# EAGLE design UI-Board (EAGLE 9.2.0)
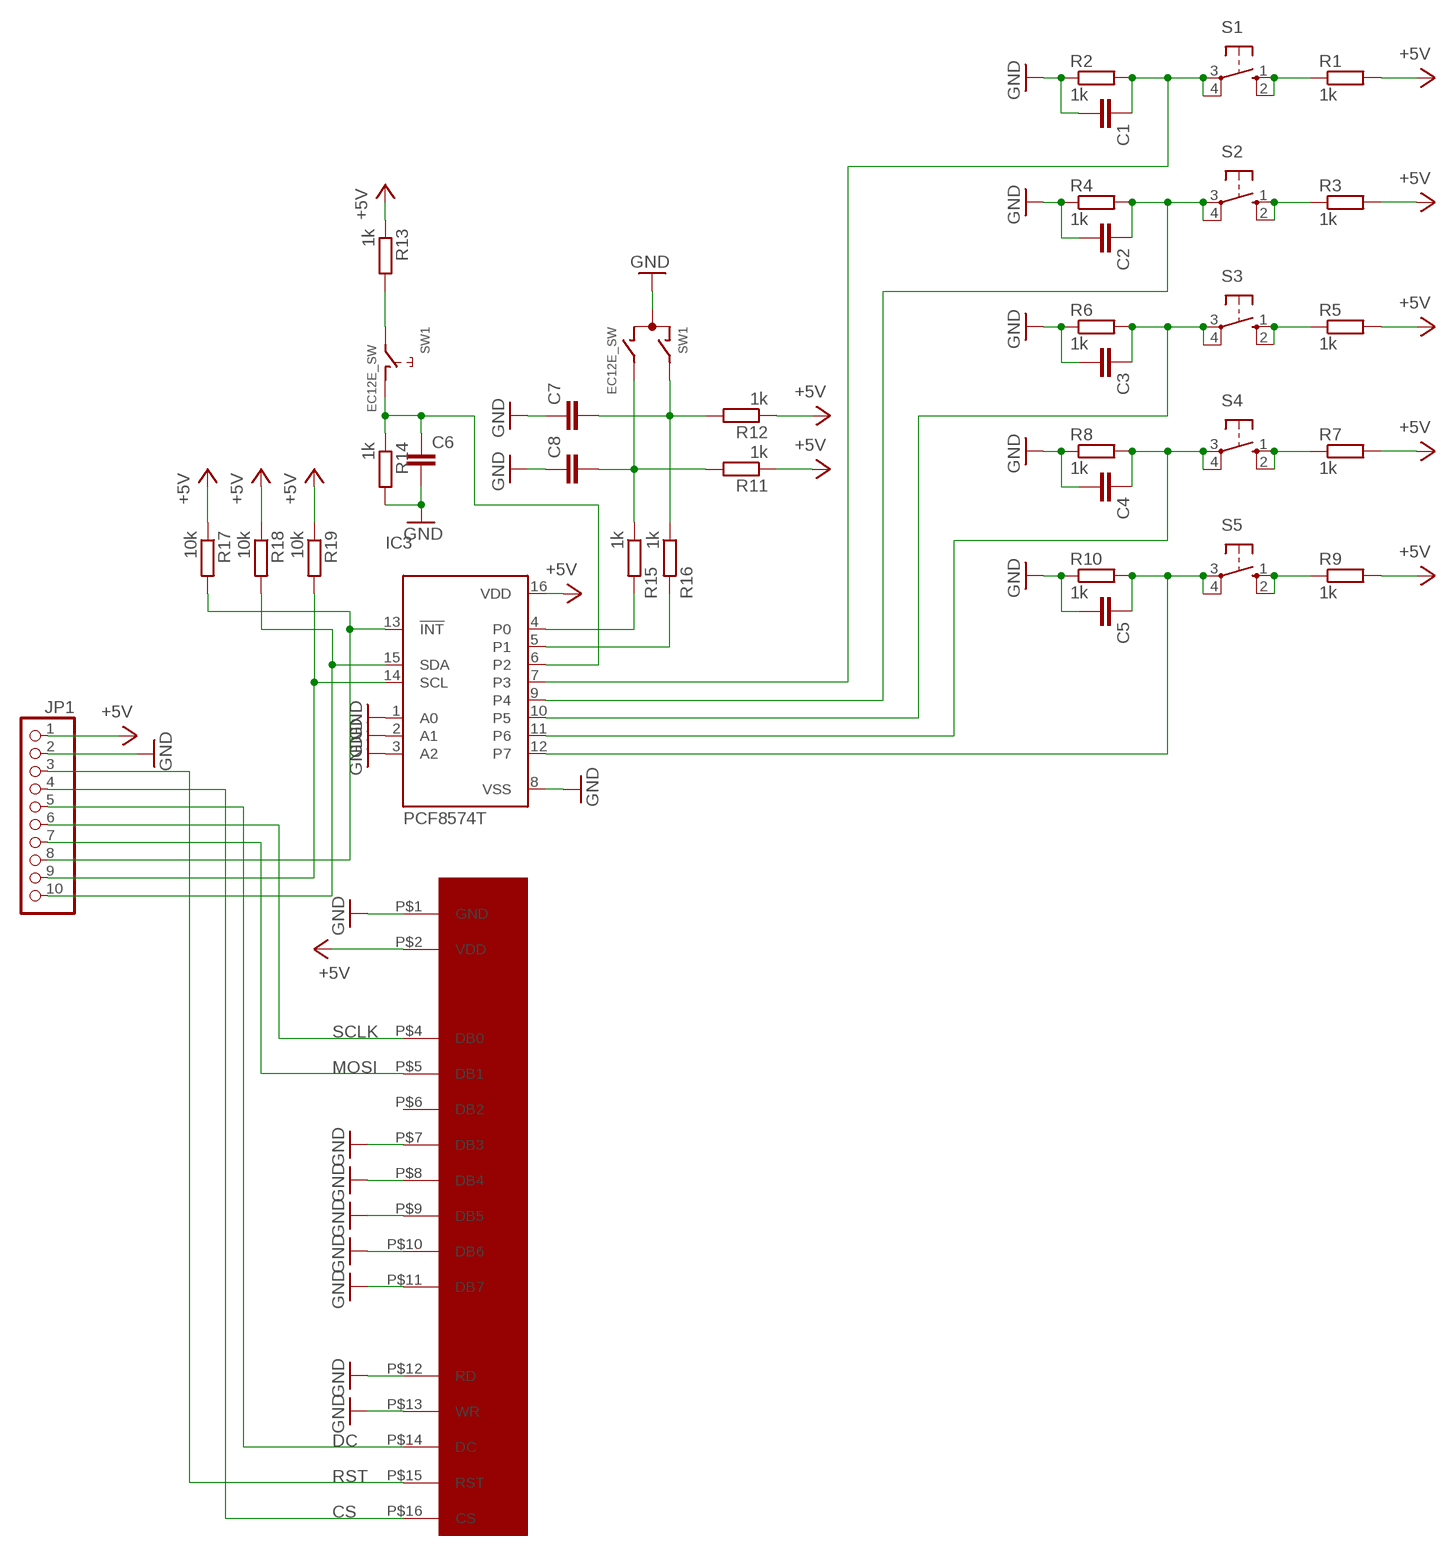
[diagram p0: schematic, sheet 1]

## Parts
C1  C-EUC0805  [C0805]
C2  C-EUC0805  [C0805]
C3  C-EUC0805  [C0805]
C4  C-EUC0805  [C0805]
C5  C-EUC0805  [C0805]
C6  C-EUC0805  [C0805]
C7  C-EUC0805  [C0805]
C8  C-EUC0805  [C0805]
IC3  PCF8574T  [SO16W]
JP1  PINHD-1X10/90  [1X10/90]
R1  1k  R-EU_R0805  [R0805]
R2  1k  R-EU_R0805  [R0805]
R3  1k  R-EU_R0805  [R0805]
R4  1k  R-EU_R0805  [R0805]
R5  1k  R-EU_R0805  [R0805]
R6  1k  R-EU_R0805  [R0805]
R7  1k  R-EU_R0805  [R0805]
R8  1k  R-EU_R0805  [R0805]
R9  1k  R-EU_R0805  [R0805]
R10  1k  R-EU_R0805  [R0805]
R11  1k  R-EU_R0805  [R0805]
R12  1k  R-EU_R0805  [R0805]
R13  1k  R-EU_R0805  [R0805]
R14  1k  R-EU_R0805  [R0805]
R15  1k  R-EU_R0805  [R0805]
R16  1k  R-EU_R0805  [R0805]
R17  10k  R-EU_R0805  [R0805]
R18  10k  R-EU_R0805  [R0805]
R19  10k  R-EU_R0805  [R0805]
S1  10-XX  [B3F-10XX]
S2  10-XX  [B3F-10XX]
S3  10-XX  [B3F-10XX]
S4  10-XX  [B3F-10XX]
S5  10-XX  [B3F-10XX]
SW1  EC12E_SW  [ALPS_EC12E_SW]
U$1  OLED64X256  [OLED64X256]

## Nets
+5V: IC3.16(VDD) JP1.1 R1.2 R3.2 R5.2 R7.2 R9.2 R11.1 R12.1 R13.1 R17.1 R18.1 R19.1 U$1.P$2(VDD)
CS: JP1.4 U$1.P$16(CS)
DC: JP1.5 U$1.P$14(DC)
GND: C1.2 C2.2 C3.2 C4.2 C5.2 C6.2 C7.1 C8.1 IC3.1(A0) IC3.2(A1) IC3.3(A2) IC3.8(VSS) JP1.2 R2.1 R4.1 R6.1 R8.1 R10.1 R14.2 SW1.C U$1.P$1(GND) U$1.P$7(DB3) U$1.P$8(DB4) U$1.P$9(DB5) U$1.P$10(DB6) U$1.P$11(DB7) U$1.P$12(RD) U$1.P$13(WR)
INT: IC3.13(!INT) JP1.8 R17.2
MOSI: JP1.7 U$1.P$5(DB1)
N$14: R1.1 S1.1(S) S1.2(S1)
N$15: R3.1 S2.1(S) S2.2(S1)
N$16: R5.1 S3.1(S) S3.2(S1)
N$17: R7.1 S4.1(S) S4.2(S1)
N$18: R9.1 S5.1(S) S5.2(S1)
N$19: IC3.4(P0) R15.2
N$20: C5.1 IC3.12(P7) R10.2 S5.3(P) S5.4(P1)
N$21: C4.1 IC3.11(P6) R8.2 S4.3(P) S4.4(P1)
N$22: C3.1 IC3.10(P5) R6.2 S3.3(P) S3.4(P1)
N$23: C2.1 IC3.9(P4) R4.2 S2.3(P) S2.4(P1)
N$24: C1.1 IC3.7(P3) R2.2 S1.3(P) S1.4(P1)
N$25: IC3.5(P1) R16.2
N$26: C8.2 R11.2 R15.1 SW1.B
N$27: C7.2 R12.2 R16.1 SW1.A
N$28: C6.1 IC3.6(P2) R14.1 SW1.D
N$31: R13.2 SW1.E
RST: JP1.3 U$1.P$15(RST)
SCL: IC3.14(SCL) JP1.9 R19.2
SCLK: JP1.6 U$1.P$4(DB0)
SDA: IC3.15(SDA) JP1.10 R18.2
Unconnected: SW1.GND1(G) SW1.GND2(G) U$1.P$6(DB2)

## Library data of the parts
C1-C8 = rcl:C-EU: CAPACITOR, European symbol; SPICEPREFIX: C
IC3 = micro-philips:PCF8574: I2C-Bus Remote 8-bit I/O expander http://www.semiconductors.philips.com/acrobat_download/datasheets/PCF8574_4.pdf; MPN: PCF8574T/3,512; OC_FARNELL: 1201255; OC_NEWARK: 70R6870
JP1 = pinhead:PINHD-1X10: PIN HEADER
R1-R19 = rcl:R-EU_: RESISTOR, European symbol; SPICEPREFIX: R
S1-S5 = switch-omron:10-XX: OMRON SWITCH; MPN: B3F-1000; OC_FARNELL: 176432; OC_NEWARK: 36M3542
SW1 = switch-alps:EC12E_SW: ALPS rotary Encoder EC12E series with switch; MPN: EC12E2424407; OC_FARNELL: 1520813; OC_NEWARK: 74M1068
U$1 = OLED:OLED64X256

## Board
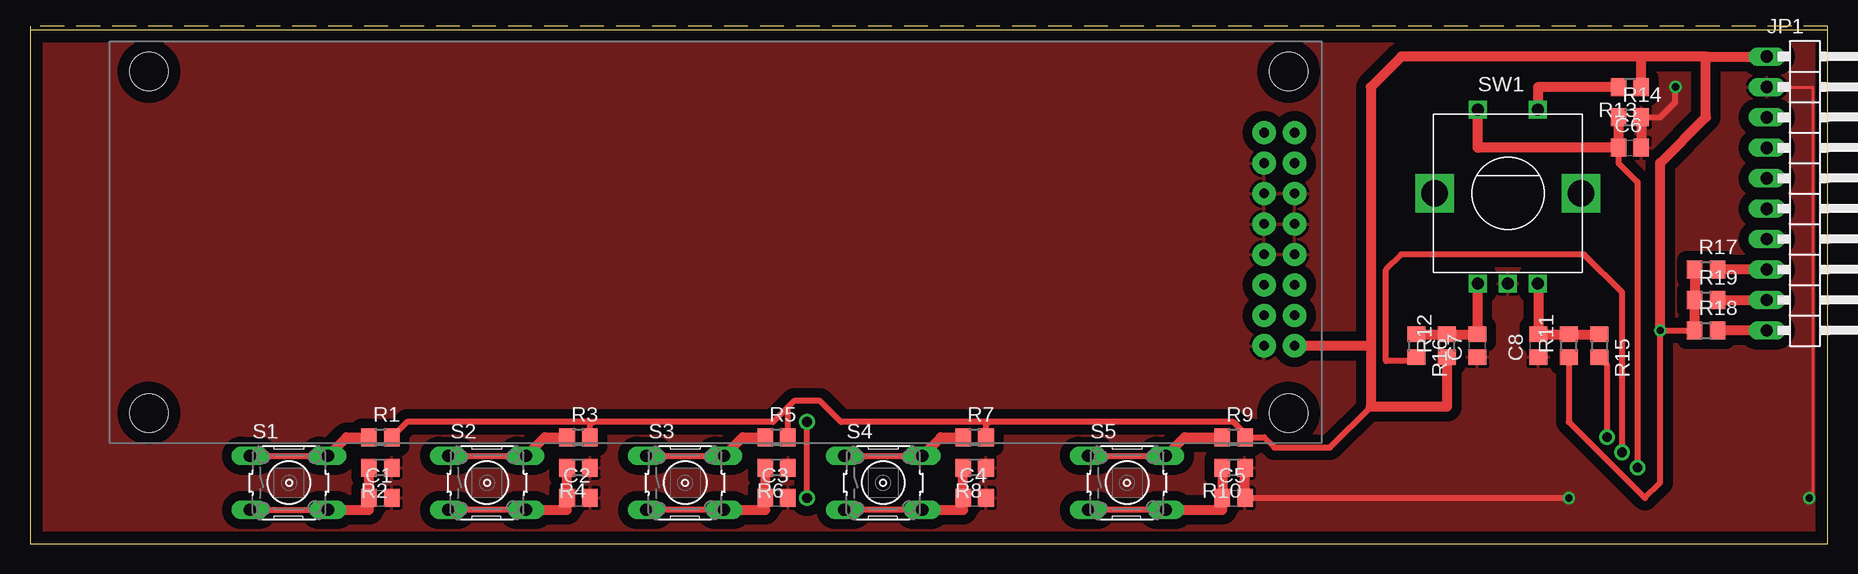
[diagram p1: board, top side]
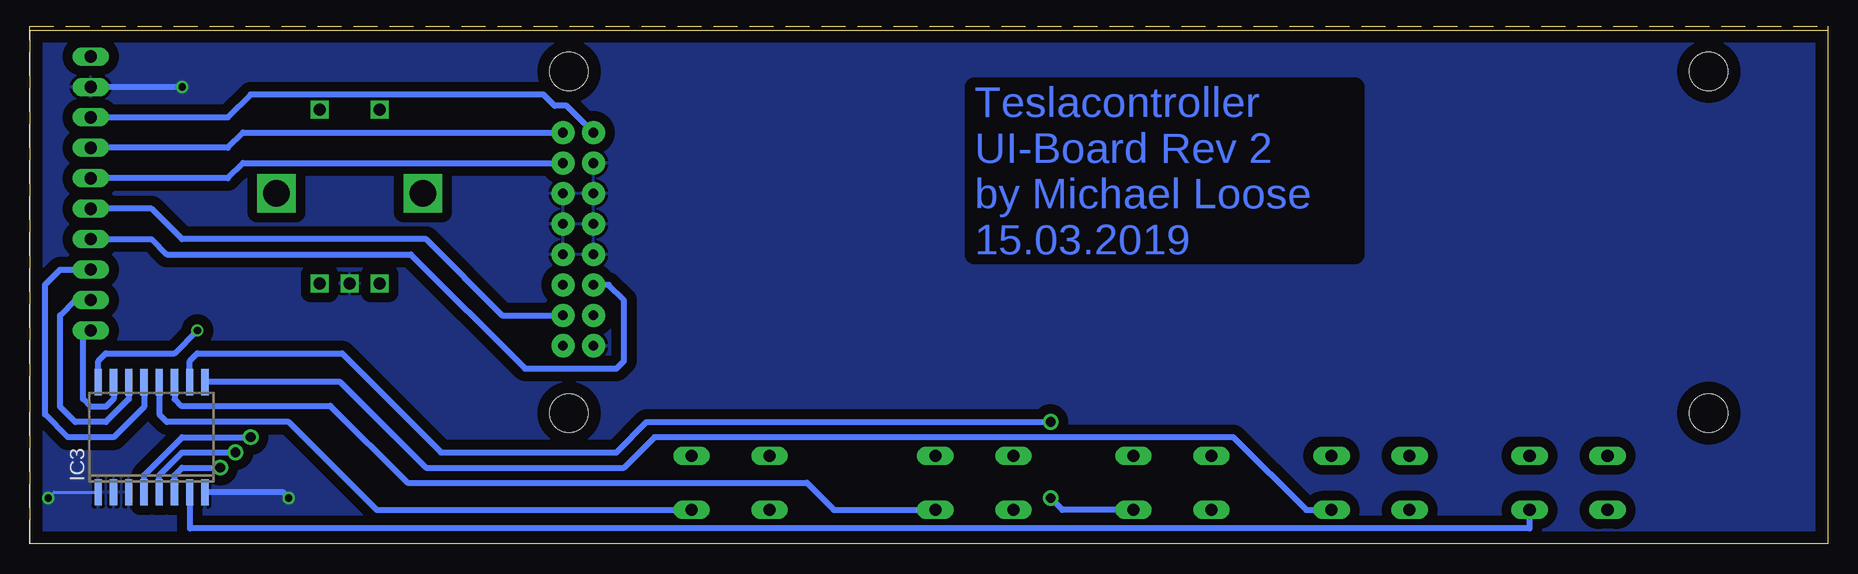
[diagram p2: board, bottom side, seen from below]

Size 149.84 x 42.85 mm. Coordinates in mm from the lower left corner, seen from the top.
Outline: 0,0 149.84,0 149.84,42.85 0,42.85 0,0
Copper layers (1*16): Top 0.035mm / dielectric 1.5mm / Bottom 0.035mm
Design rules "default": minimum track width 10mil, minimum drill 24mil, track to track 8mil, track to pad 8mil, pad to pad 8mil, via to via 8mil, smd to smd 8mil, copper to edge 40mil, drill to drill 8mil, minimum pad ring 10mil, minimum via ring 8mil, stop-mask expansion 4mil, vias tented up to drill 0mil, thermal gap 10mil
Milling: 130 lines

### Footprints (pad centres in the part's own frame; a part is rotated, then mirrored left to right if it is on the bottom)
C0805 = smd 1.3 x 1.5: 1 -0.95,0; 2 0.95,0
SO16W = smd 0.6 x 2.2: 1 -4.445,-4.6; 2 -3.175,-4.6; 3 -1.905,-4.6; 4 -0.635,-4.6; 5 0.635,-4.6; 6 1.905,-4.6; 7 3.175,-4.6; 8 4.445,-4.6; 9 4.445,4.6; 10 3.175,4.6; 11 1.905,4.6; 12 0.635,4.6; 13 -0.635,4.6; 14 -1.905,4.6; 15 -3.175,4.6; 16 -4.445,4.6
1X10/90 = drill 1.016 long: 1 -11.43,-3.81; 2 -8.89,-3.81; 3 -6.35,-3.81; 4 -3.81,-3.81; 5 -1.27,-3.81; 6 1.27,-3.81; 7 3.81,-3.81; 8 6.35,-3.81; 9 8.89,-3.81; 10 11.43,-3.81
R0805 = smd 1.3 x 1.5: 1 -0.95,0; 2 0.95,0
B3F-10XX = drill 1.016 long: 1 -3.251,2.261; 2 3.251,2.261; 3 -3.251,-2.261; 4 3.251,-2.261
ALPS_EC12E_SW = drill 1 square: A -2.5,-7.5; B 2.5,-7.5; C 0,-7.5; D -2.5,7; E 2.5,7 | drill 2.2 square: GND1 -6.1,0; GND2 6.1,0
OLED64X256 = drill 0.8 pad 1.93: P$1 96.52,8.89; P$2 99.06,8.89; P$3 96.52,11.43; P$4 99.06,11.43; P$5 96.52,13.97; P$6 99.06,13.97; P$7 96.52,16.51; P$8 99.06,16.51; P$9 96.52,19.05; P$10 99.06,19.05; P$11 96.52,21.59; P$12 99.06,21.59; P$13 96.52,24.13; P$14 99.06,24.13; P$15 96.52,26.67; P$16 99.06,26.67 | hole 3.2: 3.56,3.275; 98.56,3.275; 3.56,31.775; 98.56,31.775

### Placement (x,y rotation side)
C1  29.21,3.81 0 top
C2  45.72,3.81 0 top
C3  62.23,3.81 0 top
C4  78.74,3.81 0 top
C5  100.33,3.81 0 top
C6  133.35,33.02 0 top
C7  120.65,16.51 90 top
C8  125.73,16.51 90 top
IC3  139.7,8.89 0 bottom
JP1  148.59,29.21 270 top
R1  29.21,8.89 0 top
R2  29.21,6.35 180 top
R3  45.72,8.89 0 top
R4  45.72,6.35 180 top
R5  62.23,8.89 0 top
R6  62.23,6.35 180 top
R7  78.74,8.89 0 top
R8  78.74,6.35 180 top
R9  100.33,8.89 0 top
R10  100.33,6.35 180 top
R11  128.27,16.51 90 top
R12  118.11,16.51 90 top
R13  133.35,38.1 180 top
R14  133.35,35.56 0 top
R15  130.81,16.51 270 top
R16  115.57,16.51 270 top
R17  139.7,22.86 0 top
R18  139.7,17.78 0 top
R19  139.7,20.32 0 top
S1  21.59,5.08 0 top
S2  38.1,5.08 0 top
S3  54.61,5.08 0 top
S4  71.12,5.08 0 top
S5  91.44,5.08 0 top
SW1  123.19,29.21 0 top
U$1  6.35,7.62 0 top

### Tracks (layer width: path | path; a pad name or v marks a point on that pad's centre or on a via)
+5V  (via drill 0.61)
  Top 0.508: 80.01,10.16 100.33,10.16 101.28,9.21 R9.2 102.86,8.89 103.72,8.03 108.36,8.03 111.76,11.43 | 80.01,10.16 67.61,10.16 65.86,11.9 63.68,11.9 63.18,11.41 | 63.18,11.41 61.93,10.16 46.99,10.16 | R1.2 31.43,10.16 46.99,10.16 | R3.2 46.67,9.84 arc-90 46.99,10.16 | R5.2 63.18,11.41 | R7.2 79.69,9.84 arc-90 80.01,10.16 | R18.1 v135.89,17.78 135.89,5.08 134.62,3.81 128.27,10.16 R11.1 | 134.62,38.42 R13.1
  Top 0.813: R12.1 118.11,11.43 111.76,11.43 111.76,16.51 | 111.76,16.51 U$1.P$2 | R18.1 R19.1 R17.1 | 139.7,40.64 JP1.1 | v135.89,17.78 135.89,31.75 139.7,35.56 139.7,40.64 | 139.7,40.64 134.62,40.64 | 134.62,40.64 114.3,40.64 111.76,38.1 111.76,16.51 | R13.1 134.3,40.32 arc-90 134.62,40.64
  Bottom 0.508: IC3.16 144.15,15.24 143.51,15.88 137.79,15.88 v135.89,17.78
CS
  Bottom 0.508: U$1.P$16 132.08,34.29 133.35,33.02 JP1.4
DC
  Bottom 0.508: U$1.P$14 132.08,31.75 133.35,30.48 JP1.5
GND  (via drill 0.61)
  Top 0.254: JP1.2 148.59,38.1 148.59,3.81 v148.32,3.81
  Top 0.508: C5.2 v128.27,3.81 | 134.62,32.7 C6.2 | R14.2 135.89,35.56 137.16,36.83 v137.16,38.1
  Top 0.813: C5.2 R10.1 | R14.2 C6.2
  Bottom 0.254: v148.32,3.81 147.84,4.29 IC3.1
  Bottom 0.508: v128.27,3.81 128.75,4.29 IC3.8 | v137.16,38.1 JP1.2
  pour Top (isolate 0.813): 149.86,0 0,0 0,42.55 149.86,42.55
  pour Bottom (isolate 0.813): 149.86,0 149.86,42.55 0,42.55 0,0
INT
  Top 0.813: JP1.8 R17.2
  Bottom 0.508: IC3.13 140.34,11.43 142.88,8.89 146.69,8.89 148.57,10.78 148.57,21.61 147.32,22.86 JP1.8
MOSI
  Bottom 0.508: JP1.7 139.7,25.4 138.43,24.13 118.11,24.13 108.58,14.61 100.97,14.61 100.33,15.24 100.33,20.32 101.6,21.59 U$1.P$5
N$14
  Top 0.508: S1.1 S1.2
  Top 0.813: S1.2 26.39,8.89 R1.1
N$15
  Top 0.508: S2.1 S2.2
  Top 0.813: S2.2 42.9,8.89 R3.1
N$16
  Top 0.508: S3.1 S3.2
  Top 0.813: S3.2 58.28,7.76 59.41,8.89 R5.1
N$17
  Top 0.508: S4.1 S4.2
  Top 0.813: S4.2 75.92,8.89 R7.1
N$18
  Top 0.508: S5.1 S5.2
  Top 0.813: S5.2 96.24,8.89 R9.1
N$19  (via drill 0.8 pad 1.3)
  Top 0.508: R15.2 131.44,14.93 v131.44,8.89
  Bottom 0.508: IC3.4 140.34,5.71 137.16,8.89 v131.44,8.89
N$20
  Top 0.508: S5.4 S5.3
  Top 0.813: S5.4 99.38,2.82 C5.1 R10.2
  Bottom 0.508: IC3.12 139.06,10.79 138.43,10.16 128.27,10.16 120.93,2.82 S5.4
N$21
  Top 0.508: S4.4 S4.3
  Top 0.813: R8.2 C4.1 77.79,2.82 S4.4
  Bottom 0.508: IC3.11 137.79,12.06 137.24,11.51 124.8,11.51 118.37,5.08 85.09,5.08 82.83,2.82 S4.4
N$22  (via drill 0.8 pad 1.3)
  Top 0.508: v64.77,3.81 v64.77,10.16 | S3.4 S3.3
  Top 0.813: R6.2 C3.1 61.28,2.82 S3.4
  Bottom 0.508: IC3.10 136.53,15.24 135.89,15.88 123.83,15.88 115.57,7.62 100.97,7.62 98.42,10.16 v64.77,10.16 | S3.4 63.78,2.82 v64.77,3.81
N$23
  Top 0.508: S2.4 S2.3
  Top 0.813: S2.4 44.77,2.82 C2.1 R4.2
  Bottom 0.508: IC3.9 123.98,13.49 116.84,6.35 100.33,6.35 97.79,8.89 49.53,8.89 43.46,2.82 S2.4
N$24
  Top 0.508: S1.3 S1.4
  Top 0.813: S1.4 28.26,2.82 C1.1 R2.2
  Bottom 0.508: IC3.7 136.53,1.27 24.84,1.27 S1.4
N$25  (via drill 0.8 pad 1.3)
  Top 0.508: R16.2 arc-90 115.25,15.24 113.03,15.24 113.03,22.86 114.3,24.13 129.54,24.13 132.72,20.95 v132.72,7.62
  Bottom 0.508: IC3.5 139.06,5.71 137.16,7.62 v132.72,7.62
N$26
  Top 0.813: SW1.B 125.73,21.71 C8.2 R11.2 R15.1
N$27
  Top 0.813: SW1.A 120.65,21.71 C7.2 R12.2 R16.1
N$28  (via drill 0.8 pad 1.3)
  Top 0.508: v133.99,6.35 133.99,30.16 132.4,31.75 C6.1
  Top 0.813: R14.1 C6.1 120.69,33.02 | 120.65,33.02 120.69,33.02 | 120.69,33.02 SW1.D
  Bottom 0.508: 137.79,4.45 IC3.6 137.79,5.71 137.16,6.35 v133.99,6.35
N$31
  Top 0.813: R13.2 125.69,38.1 SW1.E
RST
  Bottom 0.508: JP1.3 133.35,35.56 131.44,37.47 107.04,37.47 106.1,36.52 105.11,36.52 U$1.P$15
SCL
  Top 0.813: R19.2 JP1.9
  Bottom 0.508: IC3.14 141.6,12.06 143.51,10.16 146.05,10.16 147.32,11.43 147.32,19.05 146.05,20.32 JP1.9
SCLK
  Bottom 0.508: U$1.P$4 110.49,19.05 116.84,25.4 137.16,25.4 139.7,27.94 JP1.6
SDA
  Top 0.813: JP1.10 R18.2
  Bottom 0.508: IC3.15 142.88,12.06 143.51,11.43 144.78,11.43 145.41,12.06 145.41,17.14 JP1.10

### Text on the board
Bottom: Teslacontroller / UI-Board Rev 2 / by Michael Loose / 15.03.2019